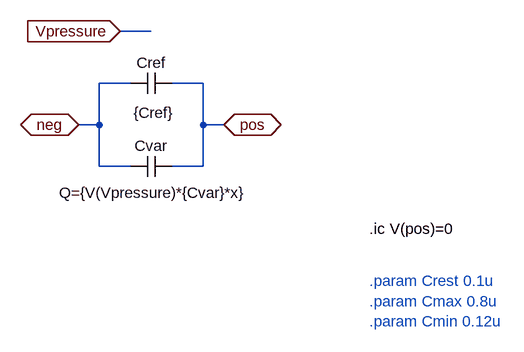
[diagram p0: schematic SENSOR_CAP.asc]
SENSOR_CAP.asc, the LTspice schematic file:
Version 4
SHEET 1 1004 700
WIRE 432 256 384 256
WIRE 400 336 352 336
WIRE 512 336 464 336
WIRE 352 400 352 336
WIRE 352 400 320 400
WIRE 512 400 512 336
WIRE 544 400 512 400
WIRE 352 464 352 400
WIRE 400 464 352 464
WIRE 512 464 512 400
WIRE 512 464 464 464
FLAG 384 256 Vpressure
IOPIN 384 256 In
FLAG 320 400 neg
IOPIN 320 400 BiDir
FLAG 544 400 pos
IOPIN 544 400 BiDir
SYMBOL cap 464 448 R90
WINDOW 0 0 32 VBottom 2
WINDOW 3 41 29 VTop 2
SYMATTR InstName Cvar
SYMATTR Value Q={V(Vpressure)*{Cvar}*x}
SYMBOL cap 464 320 R90
WINDOW 0 0 32 VBottom 2
WINDOW 3 46 28 VTop 2
SYMATTR InstName Cref
SYMATTR Value {Cref}
TEXT 768 560 Left 2 !.ic V(pos)=0
TEXT 768 640 Left 2 ;.param Crest 0.1u\n.param Cmax 0.8u\n.param Cmin 0.12u

The netlist it stands for:
* SENSOR_CAP.asc
Cvar pos neg Q={V(Vpressure)*{Cvar}*x}
Cref pos neg {Cref}
.ic V(pos)=0
* .param Crest 0.1u
* .param Cmax 0.8u
* .param Cmin 0.12u
.backanno
.end